# Altium schematic sheet AD4111_1.SchDoc
size A3; SheetNumber: 1; SheetTotal: 3
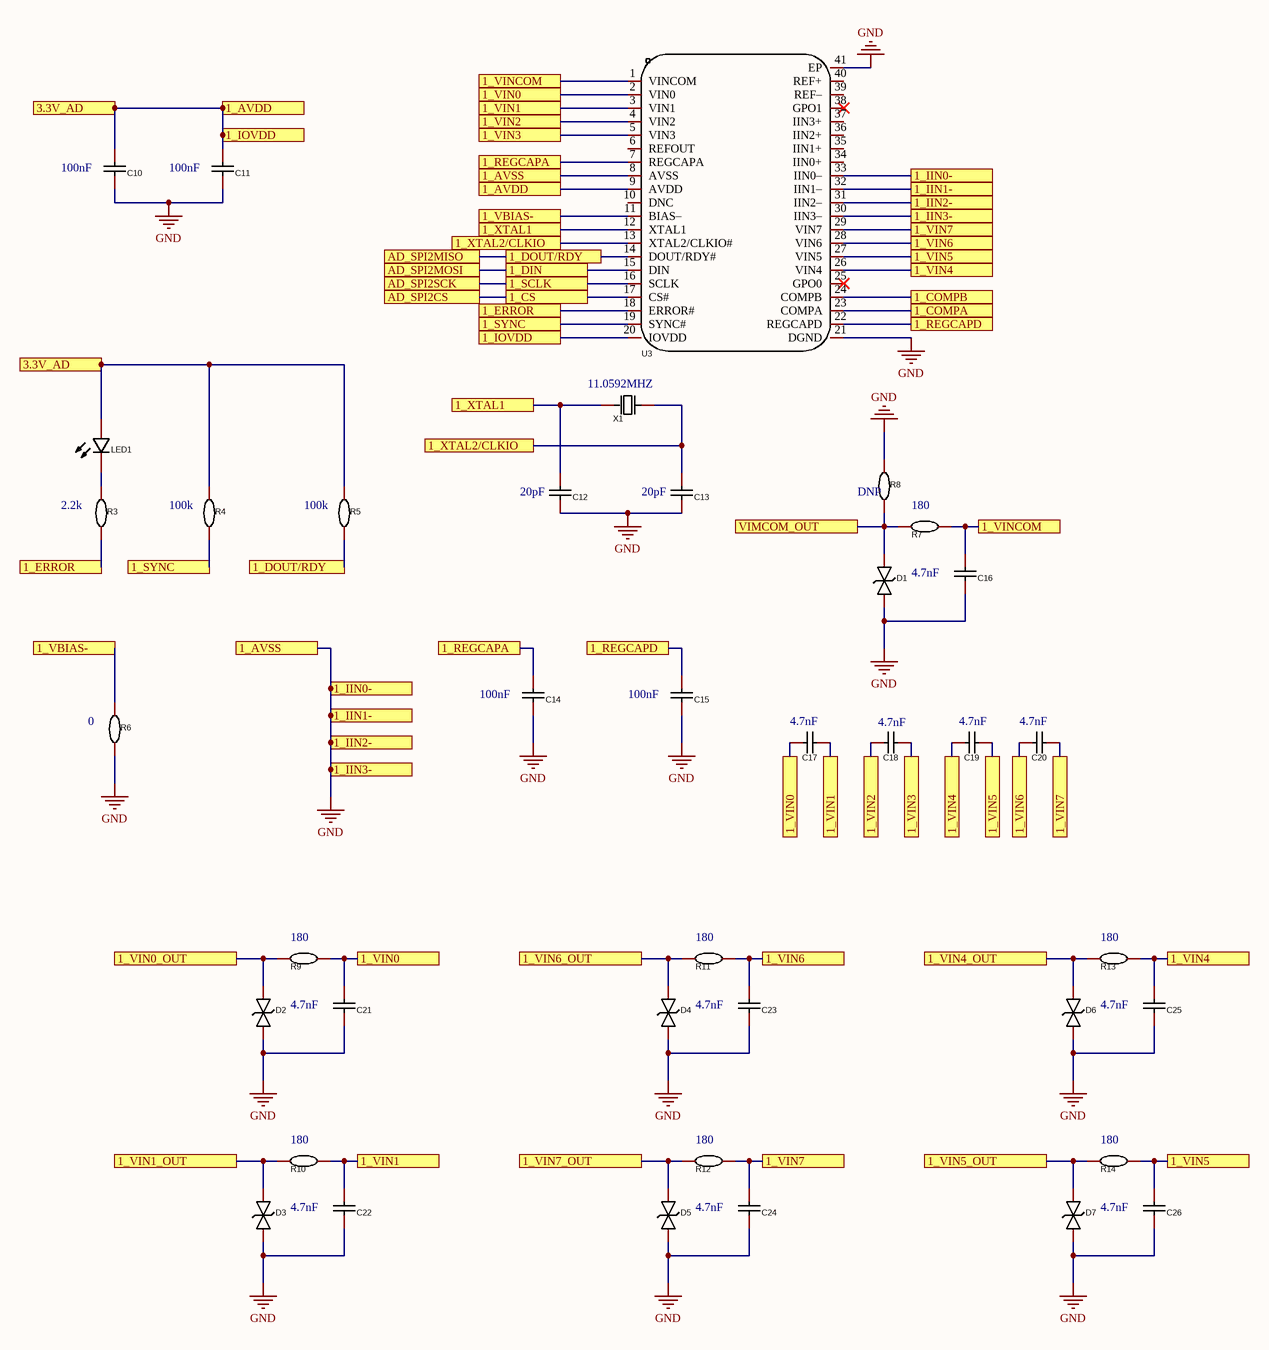
[diagram p0: AD4111_1.SchDoc]

## Parts
C10  100nF  [C0603]
C11  100nF  [C0603]
C12  20pF  [C0603]
C13  20pF  [C0603]
C14  100nF  [C0603]
C15  100nF  [C0603]
C16  4.7nF  [C0603]
C17  4.7nF  [C0603]
C18  4.7nF  [C0603]
C19  4.7nF  [C0603]
C20  4.7nF  [C0603]
C21  4.7nF  [C0603]
C22  4.7nF  [C0603]
C23  4.7nF  [C0603]
C24  4.7nF  [C0603]
C25  4.7nF  [C0603]
C26  4.7nF  [C0603]
D1  SMAJ33CA_C908829  [SMA_L4.4-W2.8-LS5.1-BI]  (value not drawn)
D2  SMAJ33CA_C908829  [SMA_L4.4-W2.8-LS5.1-BI]  (value not drawn)
D3  SMAJ33CA_C908829  [SMA_L4.4-W2.8-LS5.1-BI]  (value not drawn)
D4  SMAJ33CA_C908829  [SMA_L4.4-W2.8-LS5.1-BI]  (value not drawn)
D5  SMAJ33CA_C908829  [SMA_L4.4-W2.8-LS5.1-BI]  (value not drawn)
D6  SMAJ33CA_C908829  [SMA_L4.4-W2.8-LS5.1-BI]  (value not drawn)
D7  SMAJ33CA_C908829  [SMA_L4.4-W2.8-LS5.1-BI]  (value not drawn)
LED1  NCD0603R1_C84263  [LED0603-RD_RED]  (value not drawn)
R3  2.2k  [R0603]
R4  100k  [R0603]
R5  100k  [R0603]
R6  0  [R0603]
R7  180  [R0603]
R8  DNP  [R0603]
R9  180  [R0603]
R10  180  [R0603]
R11  180  [R0603]
R12  180  [R0603]
R13  180  [R0603]
R14  180  [R0603]
U3  AD4111BCPZ  [LFCSP-40_L6.0-W6.0-P0.50-TL-EP4.6]  (value not drawn)
X1  11.0592MHZ  [OSC-SMD_L5.0-W3.2]

## Ports
1_AVDD, 1_AVSS, 1_COMPA, 1_COMPB, 1_CS, 1_DIN, 1_DOUT/RDY, 1_ERROR, 1_IIN0-, 1_IIN1-, 1_IIN2-, 1_IIN3-, 1_IOVDD, 1_REGCAPA, 1_REGCAPD, 1_SCLK, 1_SYNC, 1_VBIAS-, 1_VIN0, 1_VIN0_OUT, 1_VIN1, 1_VIN1_OUT, 1_VIN2, 1_VIN3, 1_VIN4, 1_VIN4_OUT, 1_VIN5, 1_VIN5_OUT, 1_VIN6, 1_VIN6_OUT, 1_VIN7, 1_VIN7_OUT, 1_VINCOM, 1_XTAL1, 1_XTAL2/CLKIO, 3.3V_AD, AD_SPI2CS, AD_SPI2MISO, AD_SPI2MOSI, AD_SPI2SCK, VIMCOM_OUT

## Nets
GND: C10.1 C11.1 C12.1 C13.1 C14.1 C15.1 C16.1 C21.1 C22.1 C23.1 C24.1 C25.1 C26.1 D1.2 D2.2 D3.2 D4.2 D5.2 D6.2 D7.2 R6.1 R8.2 U3.8(AVSS) U3.21(DGND) U3.30(IIN3–) U3.31(IIN2–) U3.32(IIN1–) U3.33(IIN0–) U3.41(EP) ; port 1_AVSS, port 1_IIN0-, port 1_IIN1-, port 1_IIN2-, port 1_IIN3-
1_AVDD: C10.2 C11.2 LED1.2(A) R4.2 R5.2 U3.9(AVDD) U3.20(IOVDD) ; port 1_AVDD, port 1_IOVDD, port 3.3V_AD
1_COMPA: U3.23(COMPA) ; port 1_COMPA
1_COMPB: U3.24(COMPB) ; port 1_COMPB
1_CS: U3.17(CS#) ; port AD_SPI2CS, port 1_CS
1_DIN: U3.15(DIN) ; port AD_SPI2MOSI, port 1_DIN
1_DOUT/RDY: R5.1 U3.14(DOUT/RDY#) ; port AD_SPI2MISO, port 1_DOUT/RDY
1_ERROR: R3.1 U3.18(ERROR#) ; port 1_ERROR
1_REGCAPA: C14.2 U3.7(REGCAPA) ; port 1_REGCAPA
1_REGCAPD: C15.2 U3.22(REGCAPD) ; port 1_REGCAPD
1_SCLK: U3.16(SCLK) ; port AD_SPI2SCK, port 1_SCLK
1_SYNC: R4.1 U3.19(SYNC#) ; port 1_SYNC
1_VBIAS-: R6.2 U3.11(BIAS–) ; port 1_VBIAS-
1_VIN0: C17.1 C21.2 R9.2 U3.2(VIN0) ; port 1_VIN0
1_VIN0_OUT: D2.1 R9.1 ; port 1_VIN0_OUT
1_VIN1: C17.2 C22.2 R10.2 U3.3(VIN1) ; port 1_VIN1
1_VIN1_OUT: D3.1 R10.1 ; port 1_VIN1_OUT
1_VIN2: C18.1 U3.4(VIN2) ; port 1_VIN2
1_VIN3: C18.2 U3.5(VIN3) ; port 1_VIN3
1_VIN4: C19.1 C25.2 R13.2 U3.26(VIN4) ; port 1_VIN4
1_VIN4_OUT: D6.1 R13.1 ; port 1_VIN4_OUT
1_VIN5: C19.2 C26.2 R14.2 U3.27(VIN5) ; port 1_VIN5
1_VIN5_OUT: D7.1 R14.1 ; port 1_VIN5_OUT
1_VIN6: C20.1 C23.2 R11.2 U3.28(VIN6) ; port 1_VIN6
1_VIN6_OUT: D4.1 R11.1 ; port 1_VIN6_OUT
1_VIN7: C20.2 C24.2 R12.2 U3.29(VIN7) ; port 1_VIN7
1_VIN7_OUT: D5.1 R12.1 ; port 1_VIN7_OUT
1_VINCOM: C16.2 R7.2 U3.1(VINCOM) ; port 1_VINCOM
1_XTAL1: C12.2 U3.12(XTAL1) X1.1(OSC1) ; port 1_XTAL1
1_XTAL2/CLKIO: C13.2 U3.13(XTAL2/CLKIO#) X1.2(OSC2) ; port 1_XTAL2/CLKIO
VIMCOM_OUT: D1.1 R7.1 R8.1 ; port VIMCOM_OUT
NetLED1_1: LED1.1(K) R3.2

Not connected (* = marked no-connect by the designer): U3 6(REFOUT) 10(DNC) 25(GPO0)* 34(IIN0+) 35(IIN1+) 36(IIN2+) 37(IIN3+) 38(GPO1)* 39(REF–) 40(REF+)

## Library data of the parts
C10 C11 C14 C15 = 0603B104K500NT: 0603电容; Manufacturer: FH(风华); Add into BOM: yes; Tolerance: ±10%; Voltage Rated: 50V; Temperature Coefficient: X7R; Name: 100nF; Symbol: 0603B104K500NT; Device: 0603B104K500NT; LCSC Part Name: 100nF ±10% 50V; Supplier Part: C30926; Manufacturer Part: 0603B104K500NT; Supplier Footprint: 0603; JLCPCB Part Class: Extended Part; Datasheet: https://atta.szlcsc.com/upload/public/pdf/source/20170923/C30926_1506149436298988724.pdf; Supplier: LCSC; Convert to PCB: yes; Value: 100nF
C12 C13 C16-C26 = 0603B104K500NT: 0603电容; Manufacturer: FH(风华); Name: 100nF; Add into BOM: yes; Value: 100nF; Tolerance: ±10%; Voltage Rated: 50V; Temperature Coefficient: X7R; Symbol: 0603B104K500NT; Device: 0603B104K500NT; LCSC Part Name: 100nF ±10% 50V; Supplier Part: C30926; Manufacturer Part: 0603B104K500NT; Supplier Footprint: 0603; JLCPCB Part Class: Extended Part; Datasheet: https://atta.szlcsc.com/upload/public/pdf/source/20170923/C30926_1506149436298988724.pdf; Supplier: LCSC; Convert to PCB: yes
D1-D7 = SMAJ33CA_C908829: SMAJ33CA; Manufacturer: GOODWORK(固得沃克); Add into BOM: yes; Reverse Stand-Off Voltage (Vrwm): 33V; Maximum Clamping Voltage: 53.3V; Peak Pulse Current (Ipp)@10/1000us: 7.5A; Breakdown Voltage: 36.7V; Reverse Leakage Current (Ir): 5uA; Name: SMAJ33CA; Symbol: SMAJ33CA_C908829; Device: SMAJ33CA_C908829; LCSC Part Name: 双向TVS 33V截止 7.5A峰值脉冲; Supplier Part: C908829; Manufacturer Part: SMAJ33CA; Supplier Footprint: SMA(DO-214AC); JLCPCB Part Class: Extended Part; Datasheet: https://atta.szlcsc.com/upload/public/pdf/source/20201231/C908757_5436EAF671B686EFC2F0DD2098F0ED89.pdf; Supplier: LCSC; Convert to PCB: yes
LED1 = NCD0603R1_C84263: LED; Manufacturer: 国星光电; Symbol: FC-DA1608HRK-620D; Add into BOM: yes; Emitted Color: 红灯; Name: NCD0603R1; Device: NCD0603R1_C84263; LCSC Part Name: 红灯; Supplier Part: C84263; Manufacturer Part: NCD0603R1; Supplier Footprint: 0603; JLCPCB Part Class: Extended Part; Datasheet: https://atta.szlcsc.com/upload/public/pdf/source/20200820/C84263_DABC6A75E58F576973B407FDBA283D60.pdf; Supplier: LCSC; Convert to PCB: yes
R3-R14 = 0603WAF1002T5E: 0603电阻; Manufacturer: UNI-ROYAL(厚声); Name: 10kΩ; Add into BOM: yes; Value: 10kΩ; Tolerance: ±1%; Power(Watts): 100mW; Temperature Coefficient: ±100ppm/℃; Overload Voltage (Max): 75V; Symbol: 0603WAF1002T5E; Device: 0603WAF1002T5E; LCSC Part Name: 厚膜电阻 10kΩ ±1% 100mW; Supplier Part: C25804; Manufacturer Part: 0603WAF1002T5E; Supplier Footprint: 0603; JLCPCB Part Class: Basic Part; Datasheet: https://atta.szlcsc.com/upload/public/pdf/source/20200306/C422600_1E6D84923E4A46A82E41ADD87F860B5C.pdf; Supplier: LCSC; Convert to PCB: yes; Type: 厚膜电阻; Operating Temperature Range: -55℃~+155℃
U3 = AD4111BCPZ: Manufacturer: ADI(亚德诺); Add into BOM: yes; Interface: 串行；SPI; differential input: 是; number of channels: 4；8; sampling frequency: 6.2kHz; resolution: 24位; Supply Voltage: 2V~5.5V; Name: AD4111BCPZ; Symbol: AD4111BCPZ; Device: AD4111BCPZ; LCSC Part Name: AD4111BCPZ; Supplier Part: C649166; Manufacturer Part: AD4111BCPZ; Supplier Footprint: LFCSP-40; JLCPCB Part Class: Extended Part; Datasheet: https://atta.szlcsc.com/upload/public/pdf/source/20220519/010EE3C44EFBAA26D33F75A00EF652F8.pdf; Supplier: LCSC; Convert to PCB: yes; Operating Temperature: -40℃~+105℃
X1 = X5032110592MSB2GI: 11.0592MHZ晶振; Manufacturer: YXC(扬兴晶振); Add into BOM: yes; Crystal Type: 贴片无源晶振; Load Capacitance: 20pF; Frequency Tolerance: ±10ppm; Frequency Stability: ±50ppm; Name: 11.0592MHz; Symbol: X5032110592MSB2GI; Device: X5032110592MSB2GI; LCSC Part Name: 11.0592MHz ±10ppm 20pF YSX530GA; Supplier Part: C112574; Manufacturer Part: X5032110592MSB2GI; Supplier Footprint: SMD5032-2P; JLCPCB Part Class: Basic Part; Datasheet: https://atta.szlcsc.com/upload/public/pdf/source/20210329/C112559_847D3CACBA33ACCEB57DEA3AEBB187A1.pdf; Supplier: LCSC; Convert to PCB: yes; Value: 11.0592MHz; Operating Temperature: -40℃~+85℃